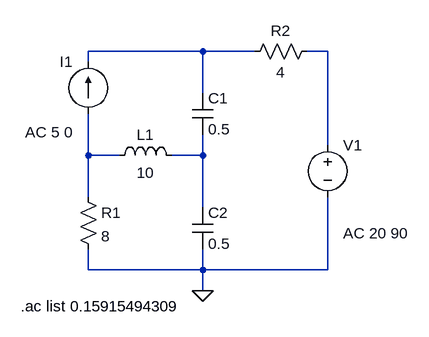
[diagram p0: schematic 10.3-example.asc]
10.3-example.asc, the LTspice schematic file:
Version 4
SHEET 1 880 680
WIRE 208 0 32 0
WIRE 288 0 208 0
WIRE 400 0 368 0
WIRE 32 16 32 0
WIRE 208 64 208 0
WIRE 400 144 400 0
WIRE 32 160 32 96
WIRE 80 160 32 160
WIRE 208 160 208 128
WIRE 208 160 160 160
WIRE 32 224 32 160
WIRE 208 240 208 160
WIRE 32 336 32 304
WIRE 208 336 208 304
WIRE 208 336 32 336
WIRE 400 336 400 224
WIRE 400 336 208 336
WIRE 208 368 208 336
FLAG 208 368 0
SYMBOL voltage 400 128 R0
WINDOW 3 24 96 Invisible 2
WINDOW 123 24 152 Left 2
WINDOW 39 24 124 Left 2
SYMATTR Value ""
SYMATTR Value2 AC 20 90
SYMATTR InstName V1
SYMBOL cap 192 64 R0
SYMATTR InstName C1
SYMATTR Value 0.5
SYMBOL cap 192 240 R0
SYMATTR InstName C2
SYMATTR Value 0.5
SYMBOL res 16 208 R0
SYMATTR InstName R1
SYMATTR Value 8
SYMBOL ind 176 176 M270
WINDOW 0 32 56 VTop 2
WINDOW 3 5 56 VBottom 2
SYMATTR InstName L1
SYMATTR Value 10
SYMBOL current 32 96 R180
WINDOW 0 24 80 Left 2
WINDOW 3 24 0 Left 2
WINDOW 123 24 -28 Left 2
WINDOW 39 0 0 Left 0
SYMATTR InstName I1
SYMATTR Value ""
SYMATTR Value2 AC 5 0
SYMBOL res 384 -16 R90
WINDOW 0 0 56 VBottom 2
WINDOW 3 32 56 VTop 2
SYMATTR InstName R2
SYMATTR Value 4
TEXT -72 392 Left 2 !.ac list 0.15915494309

The netlist it stands for:
* 10.3-example.asc
V1 N002 0 AC 20 90
C1 N001 N004 0.5
C2 N004 0 0.5
R1 N003 0 8
L1 N004 N003 10
I1 N003 N001 AC 5 0
R2 N002 N001 4
.ac list 0.15915494309
.backanno
.end